# EAGLE design KGM SRAM v1.0 (EAGLE 5.11)
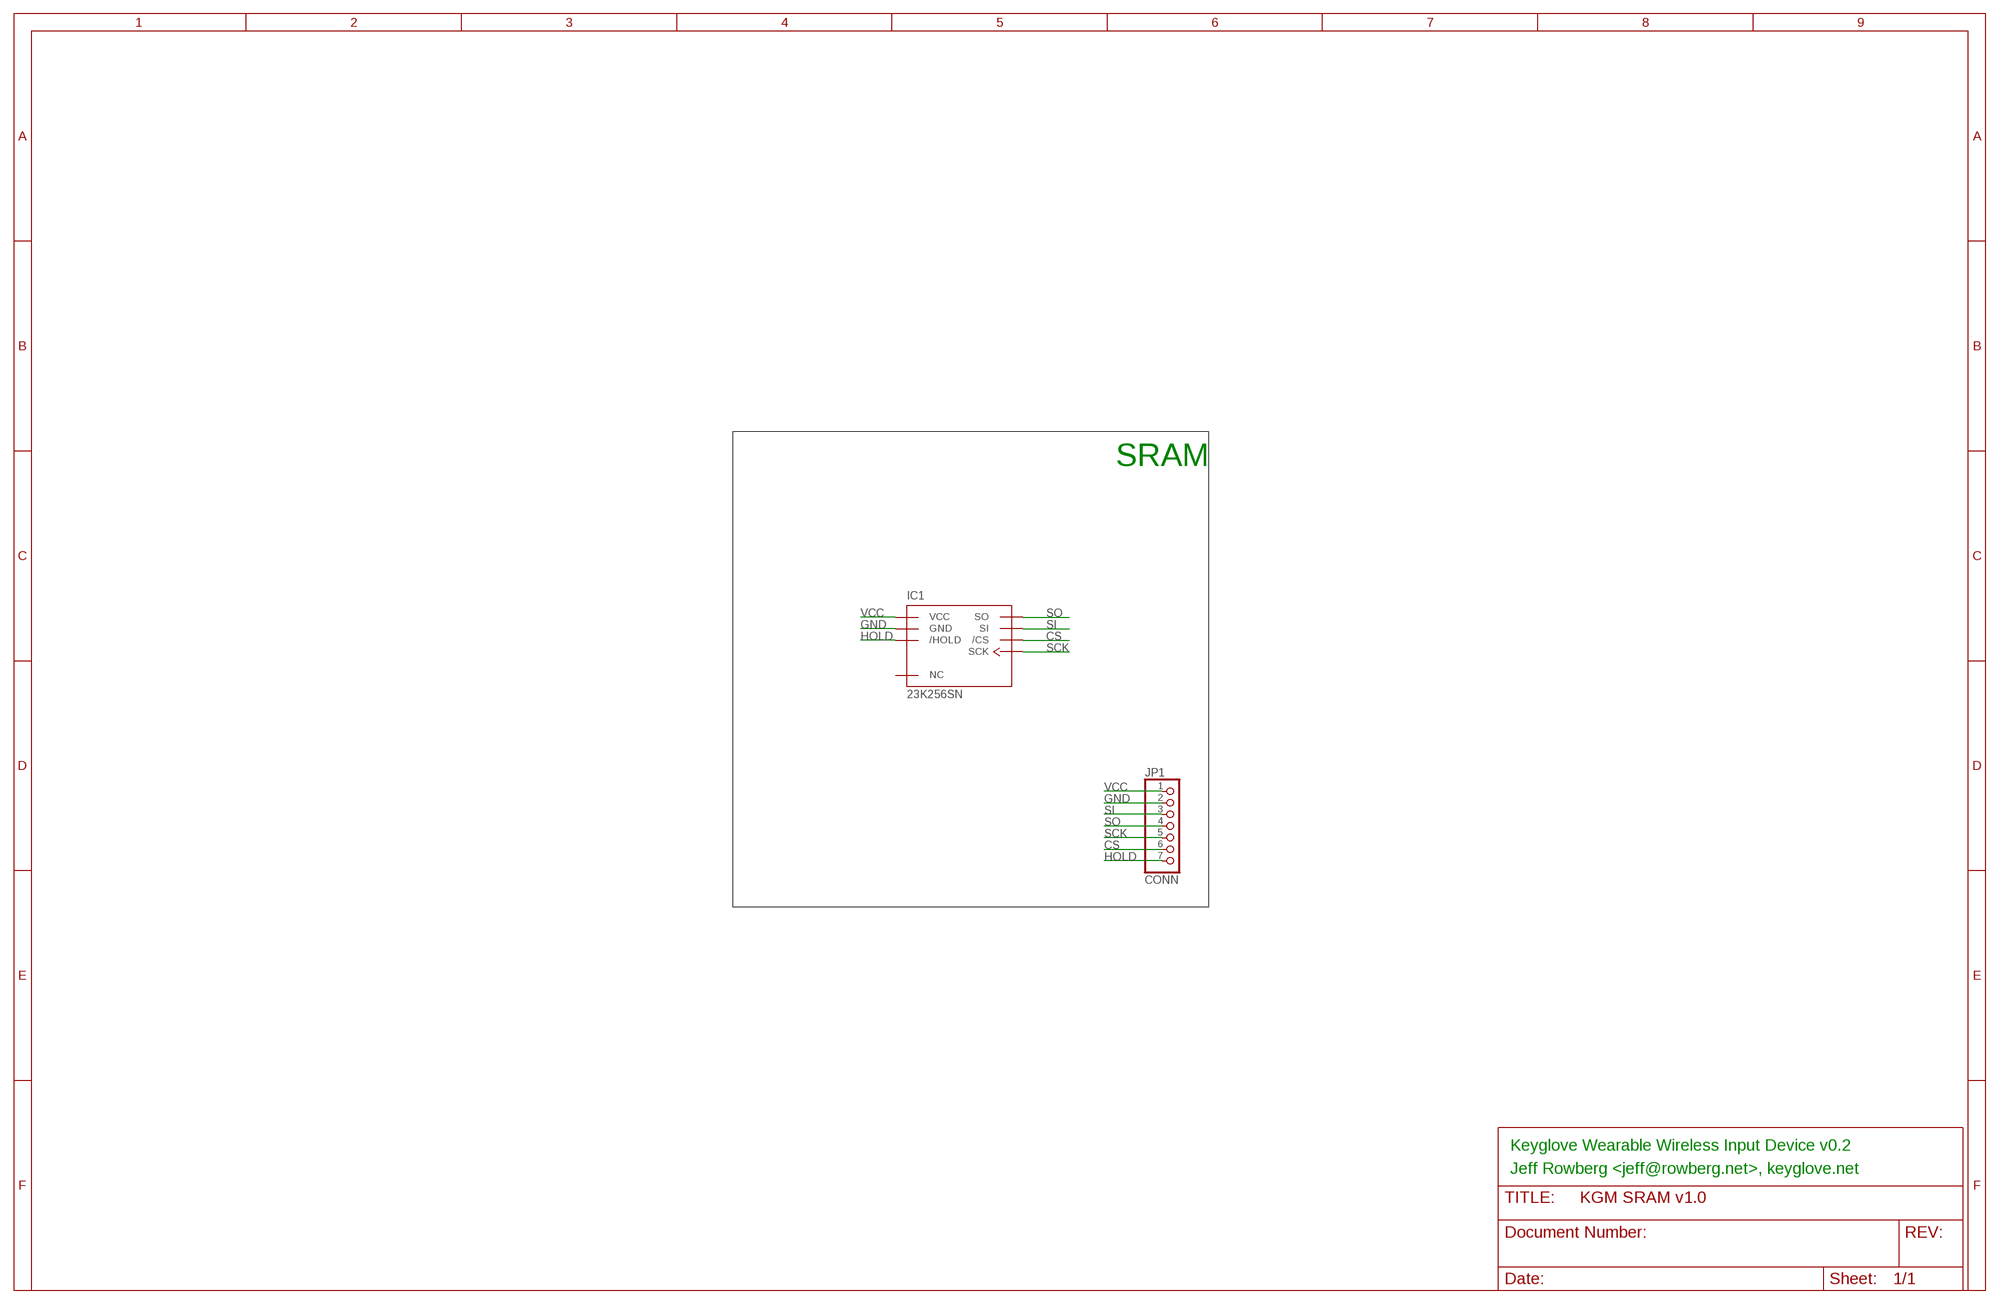
[diagram p0: schematic, sheet 1]

## Parts
IC1  23K256SN  [SO-08]
JP1  CONN  PINHD-1X7  [1X07]

## Nets
CS: IC1.1(/CS) JP1.6
GND [power]: IC1.4(GND) JP1.2
HOLD: IC1.7(/HOLD) JP1.7
SCK: IC1.6(SCK) JP1.5
SI: IC1.5(SI) JP1.3
SO: IC1.2(SO) JP1.4
VCC [power]: IC1.8(VCC) JP1.1
Unconnected: IC1.3(NC)

## Notes on the sheet
- SRAM
- Keyglove Wearable Wireless Input Device v0.2
- Jeff Rowberg <jeff@rowberg.net>, keyglove.net

## Library data of the parts
IC1 = sf-keyglove:23*: Serial SRAM SPI
JP1 = sf-pinhead:PINHD-1X7: PIN HEADER

## Net classes
0 default: width 0.152 mm, drill 0.305 mm, clearance 0.152 mm
1 power: width 0.254 mm, drill 0.305 mm, clearance 0.152 mm

## Board
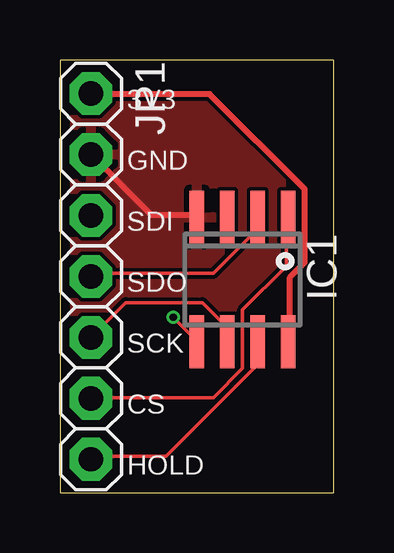
[diagram p1: board, top side]
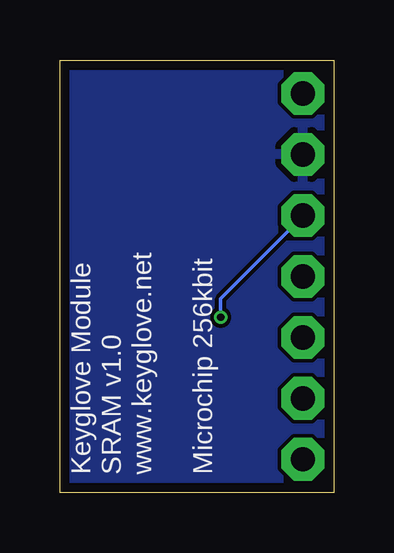
[diagram p2: board, bottom side, seen from below]

Size 11.43 x 18.03 mm. Coordinates in mm from the lower left corner, seen from the top.
Outline: 0,0 11.43,0 11.43,18.03 0,18.03 0,0
Copper layers (1*16): Top 0.0356mm / dielectric 1.5011mm / Bottom 0.0356mm
Design rules "PCBWingOrder *": minimum track width 6mil, minimum drill 12mil, track to track 6mil, track to pad 6mil, pad to pad 6mil, via to via 6mil, smd to smd 6mil, copper to edge 15mil, drill to drill 6mil, minimum pad ring 6mil, minimum via ring 5mil, stop-mask expansion 4mil, vias tented up to drill 20mil, thermal gap 10mil

### Footprints (pad centres in the part's own frame; a part is rotated, then mirrored left to right if it is on the bottom)
SO-08 = smd 0.6 x 2.2: 1 -1.905,-2.6; 2 -0.635,-2.6; 3 0.635,-2.6; 4 1.905,-2.6; 5 1.905,2.6; 6 0.635,2.6; 7 -0.635,2.6; 8 -1.905,2.6
1X07 = drill 1.016 pad 1.778 octagon: 1 -7.62,0; 2 -5.08,0; 3 -2.54,0; 4 0,0; 5 2.54,0; 6 5.08,0; 7 7.62,0

### Placement (x,y rotation side)
IC1  7.62,8.89 180 top
JP1  1.3,9.02 270 top

### Tracks (layer width: path | path; a pad name or v marks a point on that pad's centre or on a via)
CS
  Top 0.152: IC1.1 9.45,11.43 9.45,9.45 7.62,7.62 7.62,5.18 6.4,3.96 1.37,3.96 JP1.6
GND
  Top 0.254: IC1.4 5.64,11.58 3.81,11.58 JP1.2
  pour Bottom: 0.25,17.78 11.43,17.78 11.43,0.25 0.25,0.25
  pour Top: 0.25,17.78 11.43,17.78 11.43,0.25 0.25,0.25
HOLD
  Top 0.152: IC1.7 8.23,6.25 8.23,5.33 4.42,1.52 1.37,1.52 JP1.7
SCK
  Top 0.152: IC1.6 6.86,6.4 6.86,7.01 5.94,7.92 2.74,7.92 JP1.5
SI  (via drill 0.3)
  Top 0.152: v4.72,7.32 5.64,6.4 IC1.5
  Bottom 0.152: v4.72,7.32 4.72,8.08 1.37,11.43 JP1.3
SO
  Top 0.152: IC1.2 8.23,11.43 8.23,10.97 6.4,9.14 1.37,9.14 JP1.4
VCC
  Top 0.254: IC1.8 9.6,6.4 9.6,8.99 10.21,9.6 10.21,12.65 6.25,16.61 1.37,16.61 JP1.1

### Text on the board
tPlace: 3V3 | GND | SDI | SDO | SCK | CS | HOLD
bPlace: Microchip 256kbit | www.keyglove.net | SRAM v1.0 | Keyglove Module